# EAGLE design Day 0_Muhammad Fithratur Rahman_13215005 (EAGLE 7.6.0)
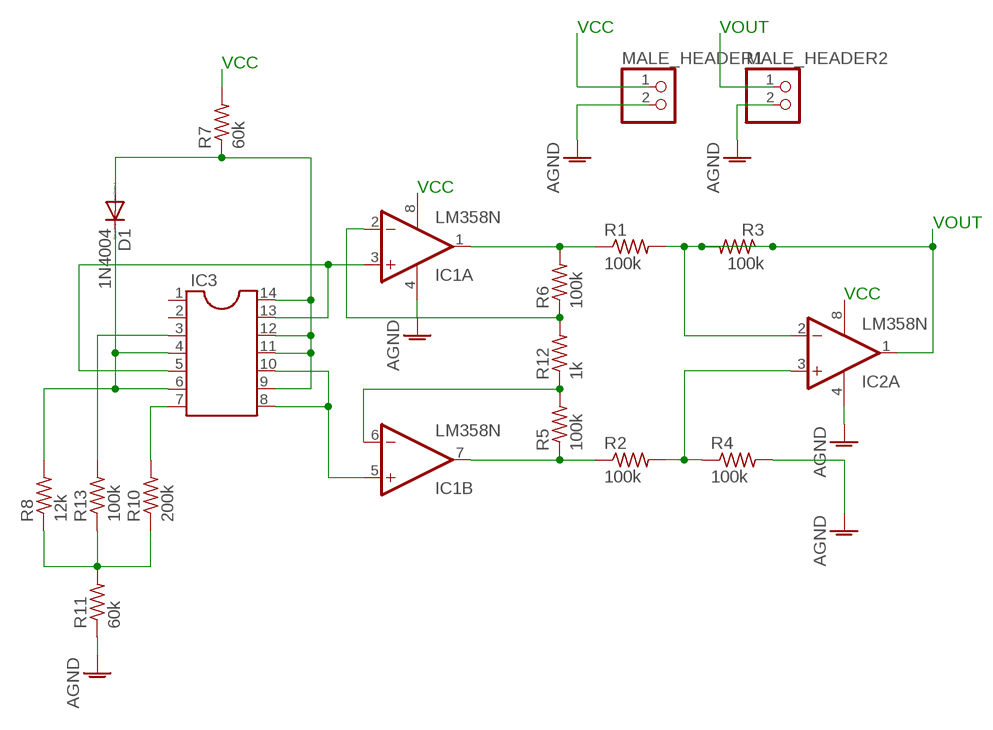
[diagram p0: schematic, sheet 1]

## Parts
D1  1N4004  [DO41-10]
IC1  LM358N  [DIL08]
IC2  LM358N  [DIL08]
IC3  DIL14  [DIL14]
MALE_HEADER1  PINHD-1X2  [1X02]
MALE_HEADER2  PINHD-1X2  [1X02]
R1  100k  R-US_0204/7  [0204/7]
R2  100k  R-US_0204/7  [0204/7]
R3  100k  R-US_0204/7  [0204/7]
R4  100k  R-US_0204/7  [0204/7]
R5  100k  R-US_0204/7  [0204/7]
R6  100k  R-US_0204/7  [0204/7]
R7  60k  R-US_0204/7  [0204/7]
R8  12k  R-US_0204/7  [0204/7]
R10  200k  R-US_0204/7  [0204/7]
R11  60k  R-US_0204/7  [0204/7]
R12  1k  R-US_0204/7  [0204/7]
R13  100k  R-US_0204/7  [0204/7]

## Nets
AGND: IC1.4(P:V-) IC2.4(P:V-) MALE_HEADER1.2 MALE_HEADER2.2 R4.2 R11.1
N$1: IC1.6(B:-IN) R5.2 R12.1
N$2: IC1.2(A:-IN) R6.1 R12.2
N$3: IC2.1(A:OUT) IC2.2(A:-IN) R1.2 R3.1 R3.2
N$4: IC2.3(A:+IN) R2.2 R4.1
N$5: D1.A IC3.9 IC3.11 IC3.12 IC3.14 R7.1
N$6: D1.C IC3.4 IC3.6 R8.2
N$7: IC1.3(A:+IN) IC3.5 IC3.13
N$8: IC3.8 IC3.10
N$9: IC3.3 R13.2
N$10: IC3.7 R10.2
N$11: R7.2
N$12: MALE_HEADER2.1
N$13: R8.1 R10.1 R11.2 R13.1
N$14: IC1.1(A:OUT) R1.1 R6.2
N$15: MALE_HEADER1.1
N$17: IC1.7(B:OUT) R2.1 R5.1
Unconnected: IC1.5(B:+IN) IC2.5(B:+IN) IC2.6(B:-IN) IC2.7(B:OUT) IC3.1 IC3.2

## Notes on the sheet
- VCC | VOUT
- VCC
- VCC
- VOUT
- VCC

## Power pins joined to a net without a drawn wire
V+: IC1.8(P:V+) IC2.8(P:V+)

## Library data of the parts
D1 = diode:1N4004: DIODE general purpose rectifier, 1 A
IC1 IC2 = linear:LM358: OP AMP also LM158; LM258; LM2904 Source: http://cache.national.com/ds/LM/LM158.pdf
IC3 = ic-package:DIL14: Dual In Line / Socket
MALE_HEADER1 MALE_HEADER2 = pinhead:PINHD-1X2: PIN HEADER
R1-R8 R10-R13 = resistor:R-US_: RESISTOR, American symbol

## Board
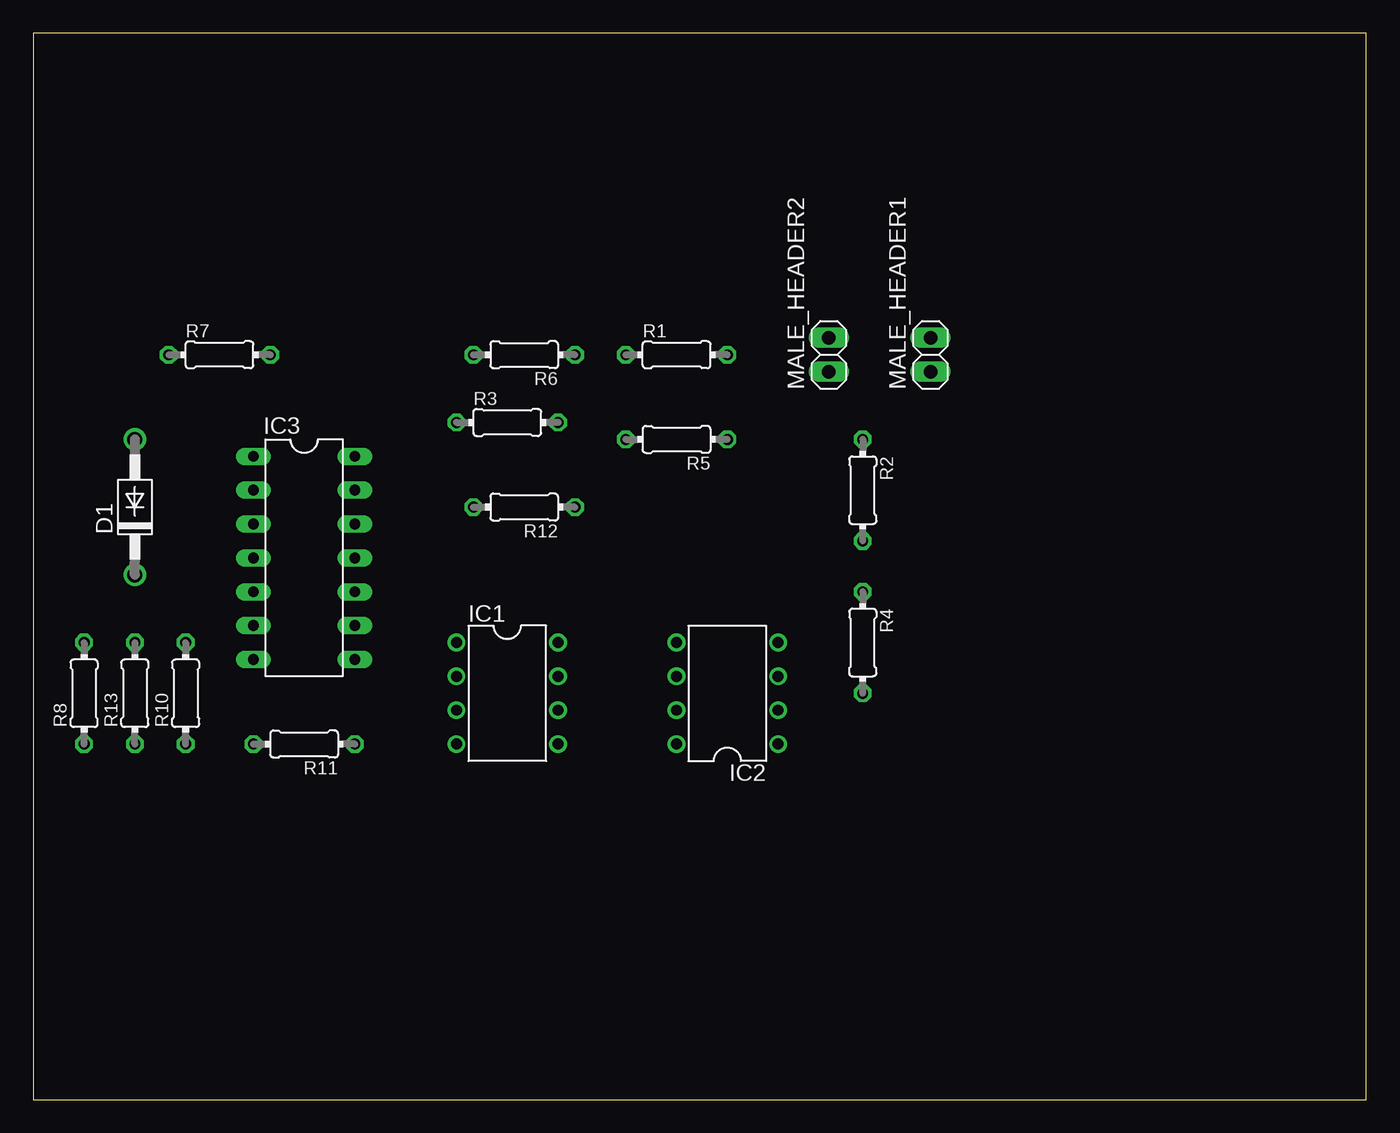
[diagram p1: board, top side]
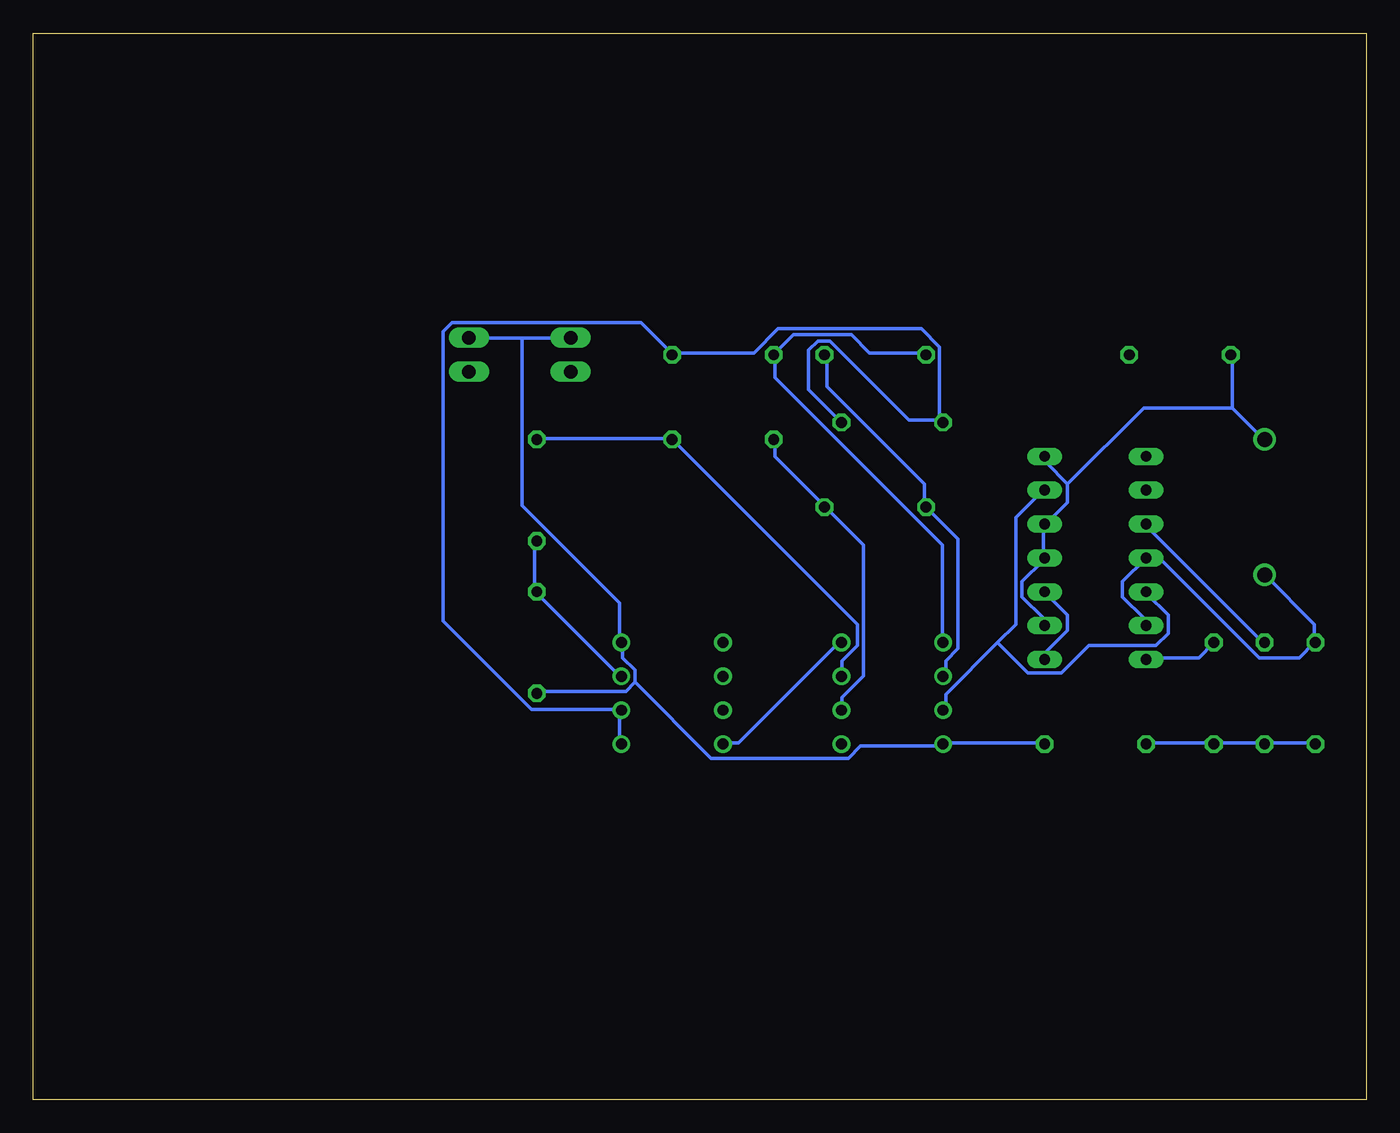
[diagram p2: board, bottom side, seen from below]

Size 100 x 80 mm. Coordinates in mm from the lower left corner, seen from the top.
Outline: 0,0 100,0 100,80 0,80 0,0
Copper layers (1*16): Top 0.035mm / dielectric 1.5mm / Bottom 0.035mm
Design rules "default *": minimum track width 15mil, minimum drill 24mil, track to track 8mil, track to pad 8mil, pad to pad 8mil, via to via 8mil, smd to smd 8mil, copper to edge 40mil, drill to drill 8mil, minimum pad ring 10mil, minimum via ring 8mil, stop-mask expansion 4mil, vias tented up to drill 0mil, thermal gap 10mil

### Footprints (pad centres in the part's own frame; a part is rotated, then mirrored left to right if it is on the bottom)
DO41-10 = drill 1.118: A 5.08,0; C -5.08,0
DIL08 = drill 0.813 pad 1.27: 1 -3.81,-3.81; 2 -1.27,-3.81; 3 1.27,-3.81; 4 3.81,-3.81; 5 3.81,3.81; 6 1.27,3.81; 7 -1.27,3.81; 8 -3.81,3.81
DIL14 = drill 0.813 long: 1 -7.62,-3.81; 2 -5.08,-3.81; 3 -2.54,-3.81; 4 0,-3.81; 5 2.54,-3.81; 6 5.08,-3.81; 7 7.62,-3.81; 8 7.62,3.81; 9 5.08,3.81; 10 2.54,3.81; 11 0,3.81; 12 -2.54,3.81; 13 -5.08,3.81; 14 -7.62,3.81
1X02 = drill 1.016 long: 1 -1.27,0; 2 1.27,0
0204/7 = drill 0.813 octagon: 1 -3.81,0; 2 3.81,0

### Placement (x,y rotation side)
D1  7.62,44.45 90 top
IC1  35.56,30.48 270 top
IC2  52.07,30.48 90 top
IC3  20.32,40.64 270 top
MALE_HEADER1  67.31,55.88 90 top
MALE_HEADER2  59.69,55.88 90 top
R1  48.26,55.88 0 top
R2  62.23,45.72 270 top
R3  35.56,50.8 0 top
R4  62.23,34.29 270 top
R5  48.26,49.53 180 top
R6  36.83,55.88 180 top
R7  13.97,55.88 0 top
R8  3.81,30.48 90 top
R10  11.43,30.48 90 top
R11  20.32,26.67 180 top
R12  36.83,44.45 180 top
R13  7.62,30.48 90 top

### Tracks (layer width: path | path; a pad name or v marks a point on that pad's centre or on a via)
AGND
  Bottom 0.254: MALE_HEADER1.2 63.32,57.15 | 63.32,57.15 MALE_HEADER2.2 | R11.1 24.23,26.75 31.55,26.75 IC1.4 31.77,26.52 37.95,26.52 38.86,25.6 49.15,25.6 54.86,31.32 | 54.86,31.32 54.86,32.23 55.78,33.15 55.78,34.29 IC2.4 56.01,34.29 56.01,37.26 63.32,44.58 63.32,57.15 | 54.86,31.32 55.55,30.63 62.18,30.63 R4.2
N$1
  Bottom 0.254: IC1.6 39.32,29.26 39.32,30.18 37.72,31.77 37.72,41.6 40.46,44.35 R12.1 40.69,44.58 44.35,48.23 44.35,49.38 R5.2
N$2
  Bottom 0.254: IC1.2 31.55,31.77 31.55,32.92 30.63,33.83 30.63,42.06 R12.2 33.15,44.58 33.15,46.18 40.46,53.49 40.46,55.78 R6.1
N$3
  Bottom 0.254: IC2.1 56.01,26.75 56.01,29.03 IC2.2 56.01,29.26 62.64,29.26 69.27,35.89 69.27,57.61 68.58,58.29 54.41,58.29 52.12,56.01 R1.2 51.89,56.01 45.95,56.01 44.12,57.84 33.38,57.84 32,56.46 32,50.98 | 32,50.98 34.29,50.98 40.23,56.92 41.15,56.92 41.83,56.24 41.83,53.26 R3.2 | 32,50.98 31.77,50.98 R3.1 32,50.98
N$4
  Bottom 0.254: IC2.3 56.01,31.77 62.18,37.95 R4.1 62.41,38.18 62.41,41.83 R2.2
N$5
  Bottom 0.254: 10.06,51.89 10.06,55.78 R7.1 | 10.06,51.89 7.77,49.61 D1.A | IC3.9 24.23,35.66 24.23,36.12 25.83,37.72 25.83,38.86 24.23,40.46 IC3.11 24.23,40.69 24.23,42.98 IC3.12 24,43.2 22.4,44.81 22.4,46.18 | 22.4,46.18 24,47.78 24,48.23 IC3.14 | 10.06,51.89 16.69,51.89 22.4,46.18
N$6
  Bottom 0.254: IC3.6 16.69,35.66 16.69,36.12 18.29,37.72 18.29,38.86 IC3.4 16.46,40.46 15.32,40.46 8,33.15 5.03,33.15 3.89,34.29 | 3.89,34.29 3.89,35.66 7.54,39.32 D1.C | 3.89,34.29 R8.2
N$7
  Bottom 0.254: 27.66,34.29 26.29,35.66 26.29,43.66 24.23,45.72 IC3.13 | 27.66,34.29 31.55,30.4 31.55,29.26 IC1.3 | 27.66,34.29 25.38,32 22.86,32 20.8,34.06 15.77,34.06 14.86,34.98 14.86,36.35 16.46,37.95 IC3.5
N$8
  Bottom 0.254: IC3.8 24,33.15 24,33.6 22.4,35.2 22.4,36.35 24,37.95 IC3.10
N$9
  Bottom 0.254: R13.2 7.77,34.29 16.46,42.98 IC3.3
N$10
  Bottom 0.254: R10.2 12.57,33.15 16.46,33.15 IC3.7
N$13
  Bottom 0.254: R8.1 3.89,26.75 7.54,26.75 R13.1 7.77,26.75 11.43,26.75 | 11.43,26.75 16.46,26.75 R11.2 | 11.43,26.75 R10.1
N$14
  Bottom 0.254: IC1.1 31.77,34.29 31.77,41.6 44.35,54.18 44.35,55.78 R1.1 44.35,56.01 42.98,57.38 38.63,57.38 37.26,56.01 33.15,56.01 R6.2
N$17
  Bottom 0.254: IC1.7 39.32,31.77 39.32,32.92 38.18,34.06 38.18,35.66 51.89,49.38 R5.1 52.12,49.61 62.18,49.61 R2.1
V+
  Bottom 0.254: IC2.8 48.23,26.75 47.09,26.75 39.55,34.29 IC1.8